# EAGLE design 4-batteries (EAGLE 9.6.2)
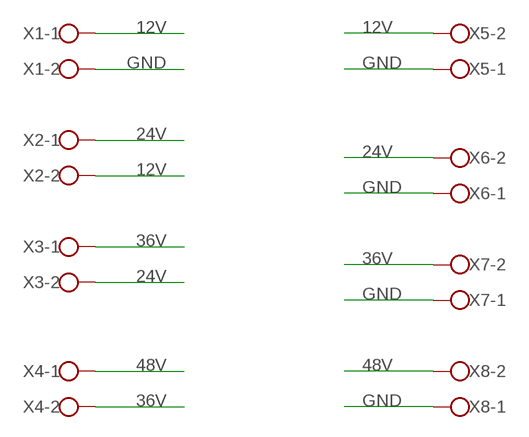
[diagram p0: schematic, sheet 1]

## Parts
X1  ROSTA.POWER  [W239-302]
X2  ROSTA.POWER  [W239-302]
X3  ROSTA.POWER  [W239-302]
X4  ROSTA.POWER  [W239-302]
X5  ROSTA.POWER  [W239-302]
X6  ROSTA.POWER  [W239-302]
X7  ROSTA.POWER  [W239-302]
X8  ROSTA.POWER  [W239-302]

## Nets
12V: X1.1 X2.2 X5.2
24V: X2.1 X3.2 X6.2
36V: X3.1 X4.2 X7.2
48V: X4.1 X8.2
GND: X1.2 X5.1 X6.1 X7.1 X8.1

## Library data of the parts
X1-X8 = MIA_LIBRARY-2-2-2:ROSTA.POWER: WAGO SCREW CLAMP; OC_FARNELL: unknown; OC_NEWARK: unknown

## Board
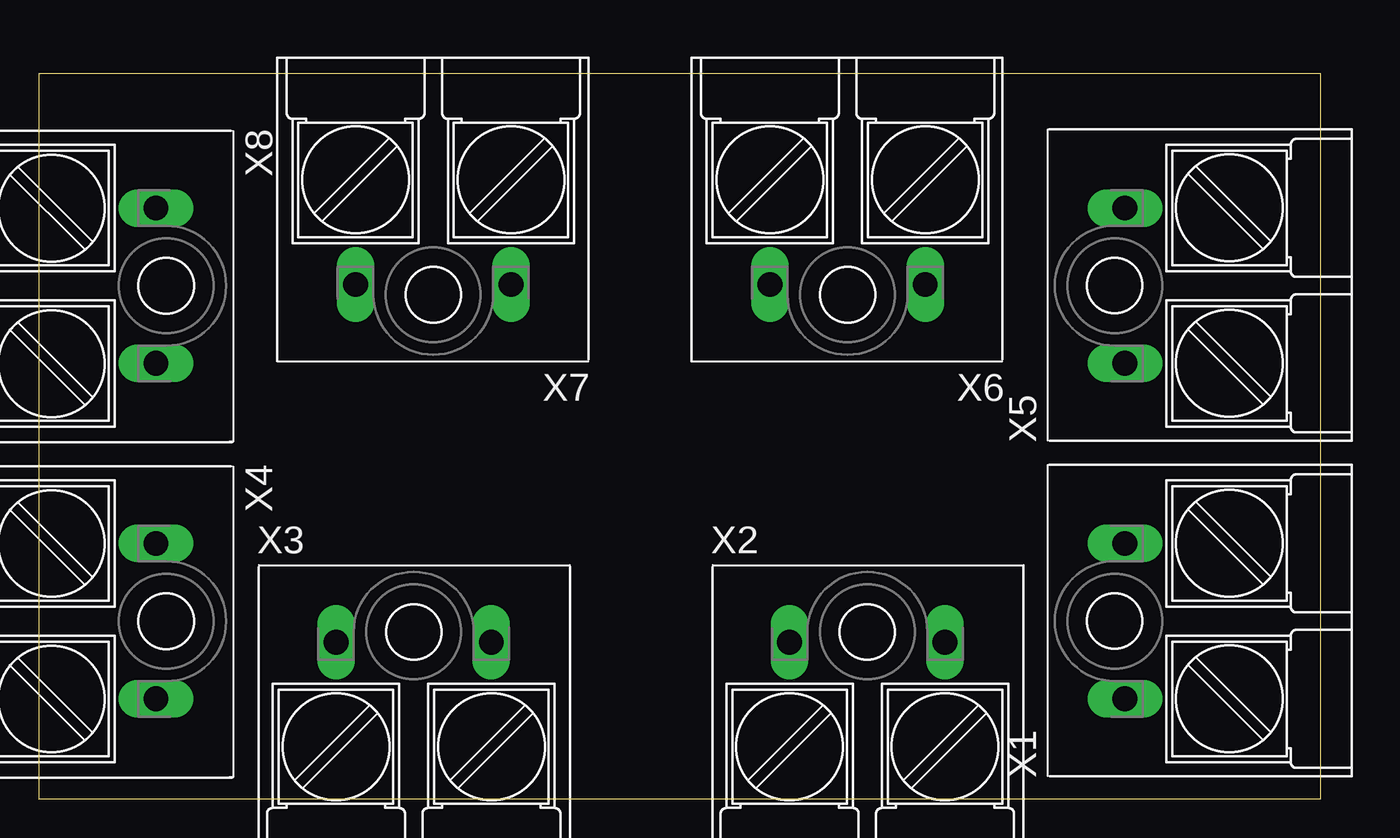
[diagram p1: board, top side]
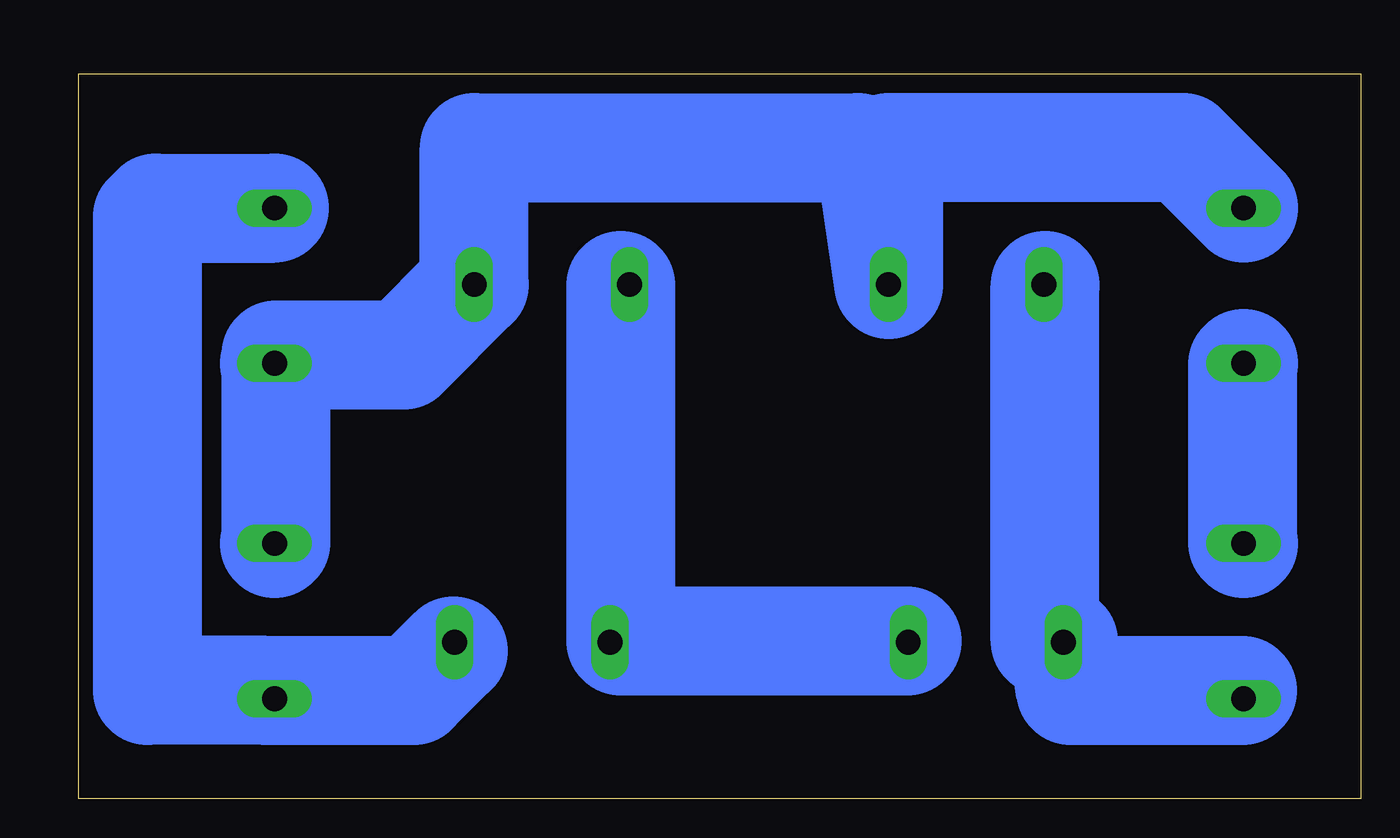
[diagram p2: board, bottom side, seen from below]

Size 82.53 x 46.66 mm. Coordinates in mm from the lower left corner, seen from the top.
Outline: 0,0 82.53,0 82.53,46.66 0,46.66 0,0
Copper layers (1*16): Top 0.035mm / dielectric 1.5mm / Bottom 0.035mm
Design rules "default *": minimum track width 1mm, minimum drill 1mm, track to track 0.8mm, track to pad 0.8mm, pad to pad 6mil, via to via 6mil, smd to smd 6mil, copper to edge 0.8mm, drill to drill 6mil, minimum pad ring 10mil, minimum via ring 8mil, stop-mask expansion 4mil, vias tented up to drill 0mil, thermal gap 10mil

### Footprints (pad centres in the part's own frame; a part is rotated, then mirrored left to right if it is on the bottom)
W239-302 = drill 1.6 long: 1 -5,5; 2 5,5

### Placement (x,y rotation side)
X1  74.93,11.43 90 top
X2  53.34,5.08 0 top
X3  24.13,5.08 0 top
X4  2.54,11.43 270 top
X5  74.93,33.02 90 top
X6  52.07,38.1 180 top
X7  25.4,38.1 180 top
X8  2.54,33.02 270 top

### Tracks (layer width: path | path; a pad name or v marks a point on that pad's centre or on a via)
12V
  Bottom 1: 58.42,9.53 X2.2 | 69.85,6.99 X1.1 70.48,6.99
  Bottom 7: 58.42,9.53 60.96,6.99 69.85,6.99 | X5.2 77.55,38.02 78.1,37.47 78.1,6.99 70.48,6.99
24V
  Bottom 1: 29.21,10.16 X3.2 | 47.62,33.02 X6.2 | 48.26,10.16 47.62,10.16 X2.1 48.26,10.16
  Bottom 7: 29.21,10.16 47.62,10.16 47.62,33.02
36V
  Bottom 1: 7.62,6.99 X4.2 | 20.32,10.16 19.69,10.16 X3.1 | 20.32,33.02 X7.2
  Bottom 7: 7.62,6.99 18.68,6.99 X3.1 | 20.32,10.16 20.32,33.02
48V
  Bottom 7: X8.2 7.62,27.94 7.62,16.51 X4.1
GND
  Bottom 1: 69.85,28.57 X5.1
  Bottom 5: 32.38,41.91 31.55,41.07
  Bottom 7: X8.1 11.43,41.91 30.4,41.91 X7.1 31.55,41.07 | 69.85,28.57 61.59,28.57 X6.1 57.07,41.91 32.38,41.91 | X5.1 69.85,27.94 69.85,16.51 X1.2